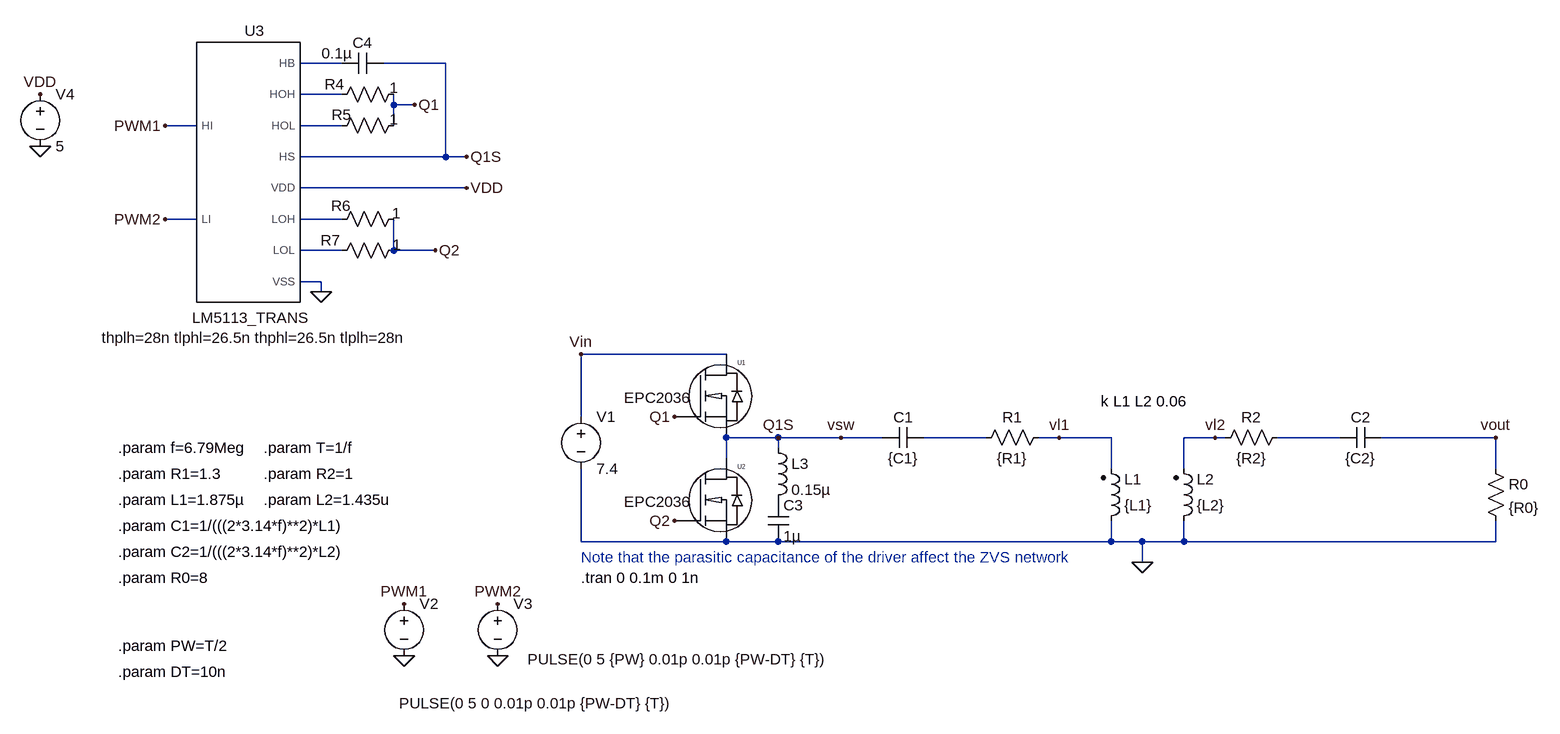
[diagram p0: schematic WPT_inv_driver.asc]
WPT_inv_driver.asc, the LTspice schematic file:
Version 4
SHEET 1 2368 1192
WIRE -1872 -80 -1936 -80
WIRE -1712 -80 -1808 -80
WIRE -1872 -32 -1936 -32
WIRE -1792 -16 -1792 -32
WIRE -1760 -16 -1792 -16
WIRE -2096 16 -2144 16
WIRE -1872 16 -1936 16
WIRE -1792 16 -1792 -16
WIRE -1712 64 -1712 -80
WIRE -1712 64 -1936 64
WIRE -1680 64 -1712 64
WIRE -1680 112 -1936 112
WIRE -2096 160 -2144 160
WIRE -1872 160 -1936 160
WIRE -1872 208 -1936 208
WIRE -1792 208 -1792 160
WIRE -1728 208 -1792 208
WIRE -1904 256 -1936 256
WIRE -1904 272 -1904 256
WIRE -1280 368 -1504 368
WIRE -1504 464 -1504 368
WIRE -1200 496 -1280 496
WIRE -1104 496 -1200 496
WIRE -1040 496 -1104 496
WIRE -880 496 -976 496
WIRE -768 496 -800 496
WIRE -688 496 -768 496
WIRE -528 496 -576 496
WIRE -512 496 -528 496
WIRE -336 496 -432 496
WIRE -96 496 -272 496
WIRE -1200 512 -1200 496
WIRE -1280 528 -1280 496
WIRE -688 544 -688 496
WIRE -576 544 -576 496
WIRE -96 544 -96 496
WIRE -1504 656 -1504 544
WIRE -1280 656 -1504 656
WIRE -1200 656 -1280 656
WIRE -688 656 -688 624
WIRE -688 656 -1200 656
WIRE -640 656 -688 656
WIRE -576 656 -576 624
WIRE -576 656 -640 656
WIRE -96 656 -96 624
WIRE -96 656 -576 656
WIRE -640 688 -640 656
FLAG -640 688 0
FLAG -768 496 vl1
FLAG -528 496 vl2
FLAG -1360 464 Q1
FLAG -1360 624 Q2
FLAG -1632 832 0
FLAG -1200 496 Q1S
FLAG -1504 368 Vin
FLAG -1776 752 PWM1
FLAG -1632 752 PWM2
FLAG -1104 496 vsw
FLAG -2336 -32 VDD
FLAG -1760 -16 Q1
FLAG -1728 208 Q2
FLAG -1680 64 Q1S
FLAG -2144 16 PWM1
FLAG -2144 160 PWM2
FLAG -1680 112 VDD
FLAG -1904 272 0
FLAG -2336 48 0
FLAG -1776 832 0
FLAG -96 496 vout
SYMBOL cap -976 480 R90
WINDOW 0 0 32 VBottom 2
WINDOW 3 32 32 VTop 2
SYMATTR InstName C1
SYMATTR Value {C1}
SYMBOL ind2 -704 640 M180
WINDOW 0 36 80 Left 2
WINDOW 3 36 40 Left 2
SYMATTR InstName L1
SYMATTR Value {L1}
SYMATTR Type ind
SYMBOL ind2 -592 640 M180
WINDOW 0 36 80 Left 2
WINDOW 3 36 40 Left 2
SYMATTR InstName L2
SYMATTR Value {L2}
SYMATTR Type ind
SYMBOL res -784 480 R90
WINDOW 0 0 56 VBottom 2
WINDOW 3 32 56 VTop 2
SYMATTR InstName R1
SYMATTR Value {R1}
SYMBOL res -416 480 R90
WINDOW 0 0 56 VBottom 2
WINDOW 3 32 56 VTop 2
SYMATTR InstName R2
SYMATTR Value {R2}
SYMBOL voltage -1776 736 R0
WINDOW 123 0 0 Left 0
WINDOW 39 0 0 Left 0
WINDOW 3 -8 169 Left 2
SYMATTR Value PULSE(0 5 0 0.01p 0.01p {PW-DT} {T})
SYMATTR InstName V2
SYMBOL EPCGaN -1360 464 R0
WINDOW 3 -78 -29 Left 2
SYMATTR Value EPC2036
SYMATTR InstName U1
SYMBOL EPCGaN -1360 624 R0
WINDOW 3 -78 -29 Left 2
SYMATTR Value EPC2036
SYMATTR InstName U2
SYMBOL voltage -1504 448 R0
WINDOW 123 0 0 Left 0
WINDOW 39 0 0 Left 0
SYMATTR InstName V1
SYMATTR Value 7.4
SYMBOL voltage -1632 736 R0
WINDOW 123 0 0 Left 0
WINDOW 39 0 0 Left 0
WINDOW 3 46 101 Left 2
SYMATTR Value PULSE(0 5 {PW} 0.01p 0.01p {PW-DT} {T})
SYMATTR InstName V3
SYMBOL cap -1216 592 R0
SYMATTR InstName C3
SYMATTR Value 1µ
SYMBOL ind -1216 496 R0
SYMATTR InstName L3
SYMATTR Value 0.15µ
SYMBOL cap -272 480 R90
WINDOW 0 0 32 VBottom 2
WINDOW 3 32 32 VTop 2
SYMATTR InstName C2
SYMATTR Value {C2}
SYMBOL res -112 528 R0
SYMATTR InstName R0
SYMATTR Value {R0}
SYMBOL LM5113_TRANS -2000 192 R0
SYMATTR InstName U3
SYMBOL voltage -2336 -48 R0
WINDOW 123 0 0 Left 0
WINDOW 39 0 0 Left 0
SYMATTR InstName V4
SYMATTR Value 5
SYMBOL res -1776 -48 R90
WINDOW 0 16 107 VBottom 2
WINDOW 3 -10 16 VTop 2
SYMATTR InstName R4
SYMATTR Value 1
SYMBOL res -1776 0 R90
WINDOW 0 15 96 VBottom 2
WINDOW 3 -9 16 VTop 2
SYMATTR InstName R5
SYMATTR Value 1
SYMBOL res -1776 144 R90
WINDOW 0 11 97 VBottom 2
WINDOW 3 -9 12 VTop 2
SYMATTR InstName R6
SYMATTR Value 1
SYMBOL res -1776 192 R90
WINDOW 0 16 113 VBottom 2
WINDOW 3 -8 11 VTop 2
SYMATTR InstName R7
SYMATTR Value 1
SYMBOL cap -1808 -96 R90
WINDOW 0 0 32 VBottom 2
WINDOW 3 -15 71 VTop 2
SYMATTR InstName C4
SYMATTR Value 0.1µ
TEXT -704 440 Left 2 !k L1 L2 0.06
TEXT -1504 712 Left 2 !.tran 0 0.1m 0 1n
TEXT -2216 816 Left 2 !.param PW=T/2
TEXT -2216 856 Left 2 !.param DT=10n
TEXT -2216 592 Left 2 !.param L1=1.875µ
TEXT -2216 552 Left 2 !.param R1=1.3
TEXT -2216 632 Left 2 !.param C1=1/(((2*3.14*f)**2)*L1)
TEXT -2216 512 Left 2 !.param f=6.79Meg
TEXT -1992 512 Left 2 !.param T=1/f
TEXT -1992 552 Left 2 !.param R2=1
TEXT -1992 592 Left 2 !.param L2=1.435u
TEXT -2216 672 Left 2 !.param C2=1/(((2*3.14*f)**2)*L2)
TEXT -2216 712 Left 2 !.param R0=8
TEXT -1504 680 Left 2 ;Note that the parasitic capacitance of the driver affect the ZVS network

The netlist it stands for:
* WPT_inv_driver.asc
C1 N006 vsw {C1}
L1 0 vl1 {L1}
L2 0 vl2 {L2}
R1 vl1 N006 {R1}
R2 N007 vl2 {R2}
V2 PWM1 0 PULSE(0 5 0 0.01p 0.01p {PW-DT} {T})
XU1 Q1 Vin vsw EPC2036  ; pins gatein drainin N_0
XU2 Q2 vsw 0 EPC2036  ; pins gatein drainin N_0
V1 Vin 0 7.4
V3 PWM2 0 PULSE(0 5 {PW} 0.01p 0.01p {PW-DT} {T})
C3 P001 0 1µ
L3 vsw P001 0.15µ
C2 vout N007 {C2}
R0 vout 0 {R0}
XU3 N002 N003 N001 PWM1 vsw PWM2 N004 N005 VDD 0 LM5113_TRANS thplh=28n tlphl=26.5n thphl=26.5n tlplh=28n  ; pins HOH HOL HB HI HS LI LOH LOL VDD VSS
V4 VDD 0 5
R4 Q1 N002 1
R5 Q1 N003 1
R6 Q2 N004 1
R7 Q2 N005 1
C4 vsw N001 0.1µ
k L1 L2 0.06
.tran 0 0.1m 0 1n
.param PW=T/2
.param DT=10n
.param L1=1.875µ
.param R1=1.3
.param C1=1/(((2*3.14*f)**2)*L1)
.param f=6.79Meg
.param T=1/f
.param R2=1
.param L2=1.435u
.param C2=1/(((2*3.14*f)**2)*L2)
.param R0=8
* Note that the parasitic capacitance of the driver affect the ZVS network
.lib EPCGanlibrary.lib
.lib LM5113_TRANS.lib
.backanno
.end